# Altium schematic sheet Morpheus_pill_bqle.SchDoc: Pill Motion Detector
size Letter; DrawnBy: Dyke Shaffer; Organization: Hello Inc.; Revision: DVT; SheetNumber: 1; SheetTotal: 4
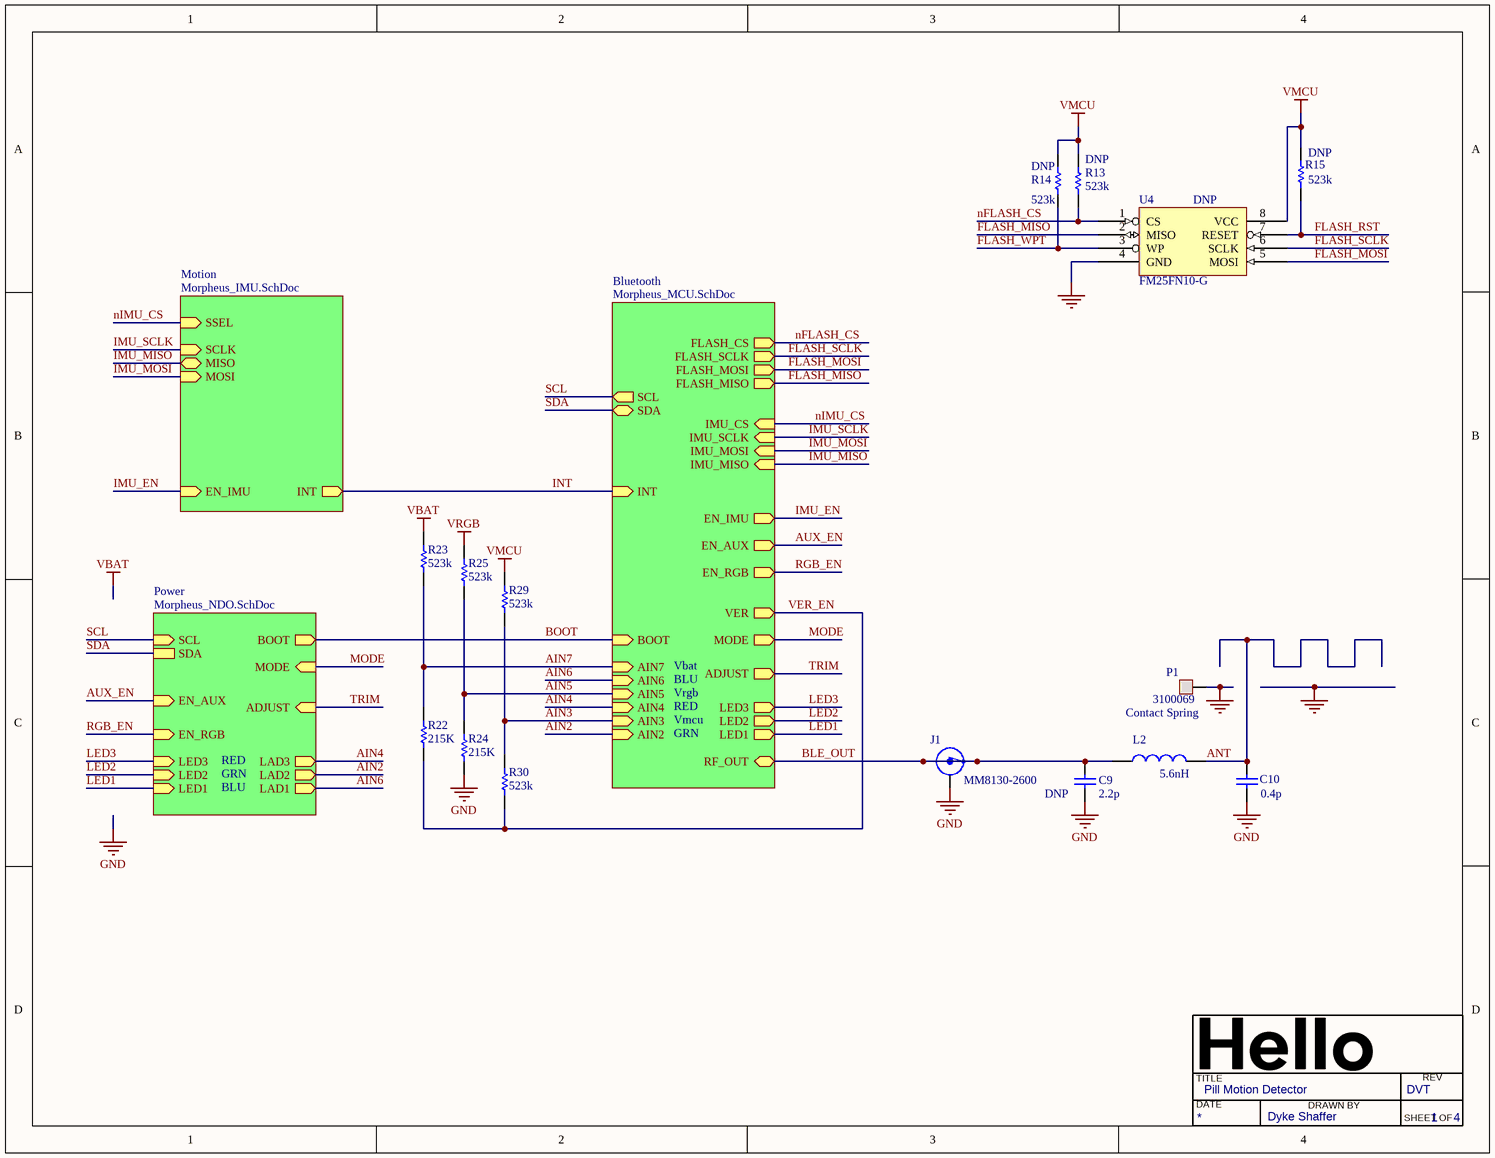
[diagram p0: Morpheus_pill_bqle.SchDoc]

## Parts
C9  DNP  value 2.2p  [CAP0402_SENSE_DVT]
C10  value 0.4p  [CAP0402_SENSE_DVT]
J1  MM8130-2600  [COAXIAL-SWF]
L2  value 5.6nH  [IND_0402]
P1  Contact Spring  PN: 3100069  [TP120X70SC]
R13  DNP  value 523k  [RES0402_SENSE_DVT]
R14  DNP  value 523k  [RES0402_SENSE_DVT]
R15  DNP  value 523k  [RES0402_SENSE_DVT]
R22  215K  [RES0402_SENSE_DVT]
R23  523k  [RES0402_SENSE_DVT]
R24  215K  [RES0402_SENSE_DVT]
R25  523k  [RES0402_SENSE_DVT]
R29  523k  [RES0402_SENSE_DVT]
R30  523k  [RES0402_SENSE_DVT]
U4  DNP  PN: FM25FN10-G  [DFN127P600x500x80-8E]

## Sub-sheets
Bluetooth = Morpheus_MCU.SchDoc: FLASH_SCLK (out), FLASH_CS (out), INT (in), LED3 (out), EN_IMU (out), AIN6 (in), BOOT (in), SCL (out), SDA, AIN7 (in), EN_AUX (out), AIN4 (in), AIN5 (in), AIN2 (in), AIN3 (in), RF_OUT, ADJUST (out), LED2 (out), LED1 (out), EN_RGB (out), VER (out), IMU_MISO (in), IMU_SCLK (in), IMU_MOSI (in), IMU_CS (in), FLASH_MOSI (out), FLASH_MISO (out), MODE (out)
Motion = Morpheus_IMU.SchDoc: MOSI (in), MISO, SCLK (in), INT (out), SSEL (in), EN_IMU (in)
Power = Morpheus_NDO.SchDoc: SDA, BOOT (out), SCL (in), LAD3 (out), LAD2 (out), LAD1 (out), EN_AUX (in), EN_RGB (in), ADJUST (in), LED3 (in), LED2 (in), LED1 (in), MODE (in)

## Nets
GND: C9.2 C10.2 J1.2(Shield) P1.1 R24.1 U4.4(GND)
VBAT: R23.2
VMCU: R13.2 R14.2 R15.2 R29.2 U4.8(VCC)
VRGB: R25.2
AIN2: sheet Bluetooth/AIN2, sheet Power/LAD2
AIN3: R29.1 R30.2 ; sheet Bluetooth/AIN3
AIN4: sheet Bluetooth/AIN4, sheet Power/LAD3
AIN5: R24.2 R25.1 ; sheet Bluetooth/AIN5
AIN6: sheet Bluetooth/AIN6, sheet Power/LAD1
AIN7: R22.2 R23.1 ; sheet Bluetooth/AIN7
ANT: C10.1 L2.2
AUX_EN: sheet Bluetooth/EN_AUX, sheet Power/EN_AUX
BLE_OUT: C9.1 J1.1(IN) J1.3(OUT) L2.1 ; sheet Bluetooth/RF_OUT
BOOT: sheet Bluetooth/BOOT, sheet Power/BOOT
FLASH_MISO: U4.2(MISO) ; sheet Bluetooth/FLASH_MISO
FLASH_MOSI: U4.5(MOSI) ; sheet Bluetooth/FLASH_MOSI
FLASH_RST: R15.1 U4.7(RESET)
FLASH_SCLK: U4.6(SCLK) ; sheet Bluetooth/FLASH_SCLK
FLASH_WPT: R14.1 U4.3(WP)
IMU_EN: sheet Bluetooth/EN_IMU, sheet Motion/EN_IMU
IMU_MISO: sheet Bluetooth/IMU_MISO, sheet Motion/MISO
IMU_MOSI: sheet Bluetooth/IMU_MOSI, sheet Motion/MOSI
IMU_SCLK: sheet Bluetooth/IMU_SCLK, sheet Motion/SCLK
INT: sheet Bluetooth/INT, sheet Motion/INT
LED1: sheet Bluetooth/LED1, sheet Power/LED1
LED2: sheet Bluetooth/LED2, sheet Power/LED2
LED3: sheet Bluetooth/LED3, sheet Power/LED3
MODE: sheet Bluetooth/MODE, sheet Power/MODE
nFLASH_CS: R13.1 U4.1(CS) ; sheet Bluetooth/FLASH_CS
nIMU_CS: sheet Bluetooth/IMU_CS, sheet Motion/SSEL
RGB_EN: sheet Bluetooth/EN_RGB, sheet Power/EN_RGB
SCL: sheet Bluetooth/SCL, sheet Power/SCL
SDA: sheet Bluetooth/SDA, sheet Power/SDA
TRIM: sheet Bluetooth/ADJUST, sheet Power/ADJUST
VER_EN: R22.1 R30.1 ; sheet Bluetooth/VER

## Notes on the sheet
- BLU
- Vbat
- Vrgb
- GRN
- RED
- Vmcu
- TITLE
- DATE
- DRAWN BY
- REV
- SHEET
- OF

## Library data of the parts
C9 = C_2.2p_5_50_NPO_0402: Chip capacitor; Vendor: Murata; PN: GRM1555C1H2R20BA01D; Tolerance: 5 %; Voltage: 50 V; Temp: NPO; Size: 0402
C10 = C_0.4p_5_50_NPO_0402: Chip capacitor; Vendor: Murata; PN: GRM1555C1Hr40BA01D; Tolerance: 5 %; Voltage: 50 V; Temp: NPO; Size: 0402
J1 = MM8130-2600: Coaxial Connector with Switch; Manufacturer: Murata; 2nd source part number: 81-MM8130-2600RA2; Artikkelnr Noca: 55029011; Artikkelnr Simpro: N.A.; Part Number: MM8130-2600; Manufacturer Part Number: MM8130-2600; Datasheet: http://www.murata.com/products/catalog/pdf/o33e.pdf; LatestRevisionDate: 2014-04-24; Pin Count: 3; Publisher: Nordic Semiconductor; Published: 2014-04-24; Value: MM8130-2600; Note: *; Supplier: Digi-Key; Supplier part number: 490-4981-1-ND; 2nd source Supplier: Mouser; Footprint Doc: COAXIAL-SWF
L2 = L_5.6n_0.1_?_270_300_?: SMD RF inductor 2.2nH; PN: L-07C5N6SV6T; Vendor: Johanson; Tolerance: 0.1; RDC: 270; I_max: 300mA; Q: ?; I_sat: ?
P1 = TP-120X70-SC: Test Pad 120x70 mil ( contact spring ); Vendor: TE Connectivity
R13-R15 R23 R25 R29 R30 = R_523k_1_0.1_0402: Chip Resistor; Vendor: Panasonic; Tolerance: 1 %; Power: 0.1 W; PN: ERJ-2RKF5233X; Model: *; Size: 0402
  R23 R25 R29 R30: Value: 523k
R22 R24 = R_215K_1_0.1_0402: Chip Resistor; Vendor: Panasonic; Tolerance: 1 %; Power: 0.1 W; PN: ERJ-2RKF2153X; Model: *; Value: 215K; Size: 0402
U4 = FM25VN10-G: Cypress SPI FRAM 128Kx8; Vendor: Fujitsu; Value: FRAM